# Altium schematic sheet Schémas V1.SchDoc
size A3; DocumentNumber: 2; SheetNumber: 1
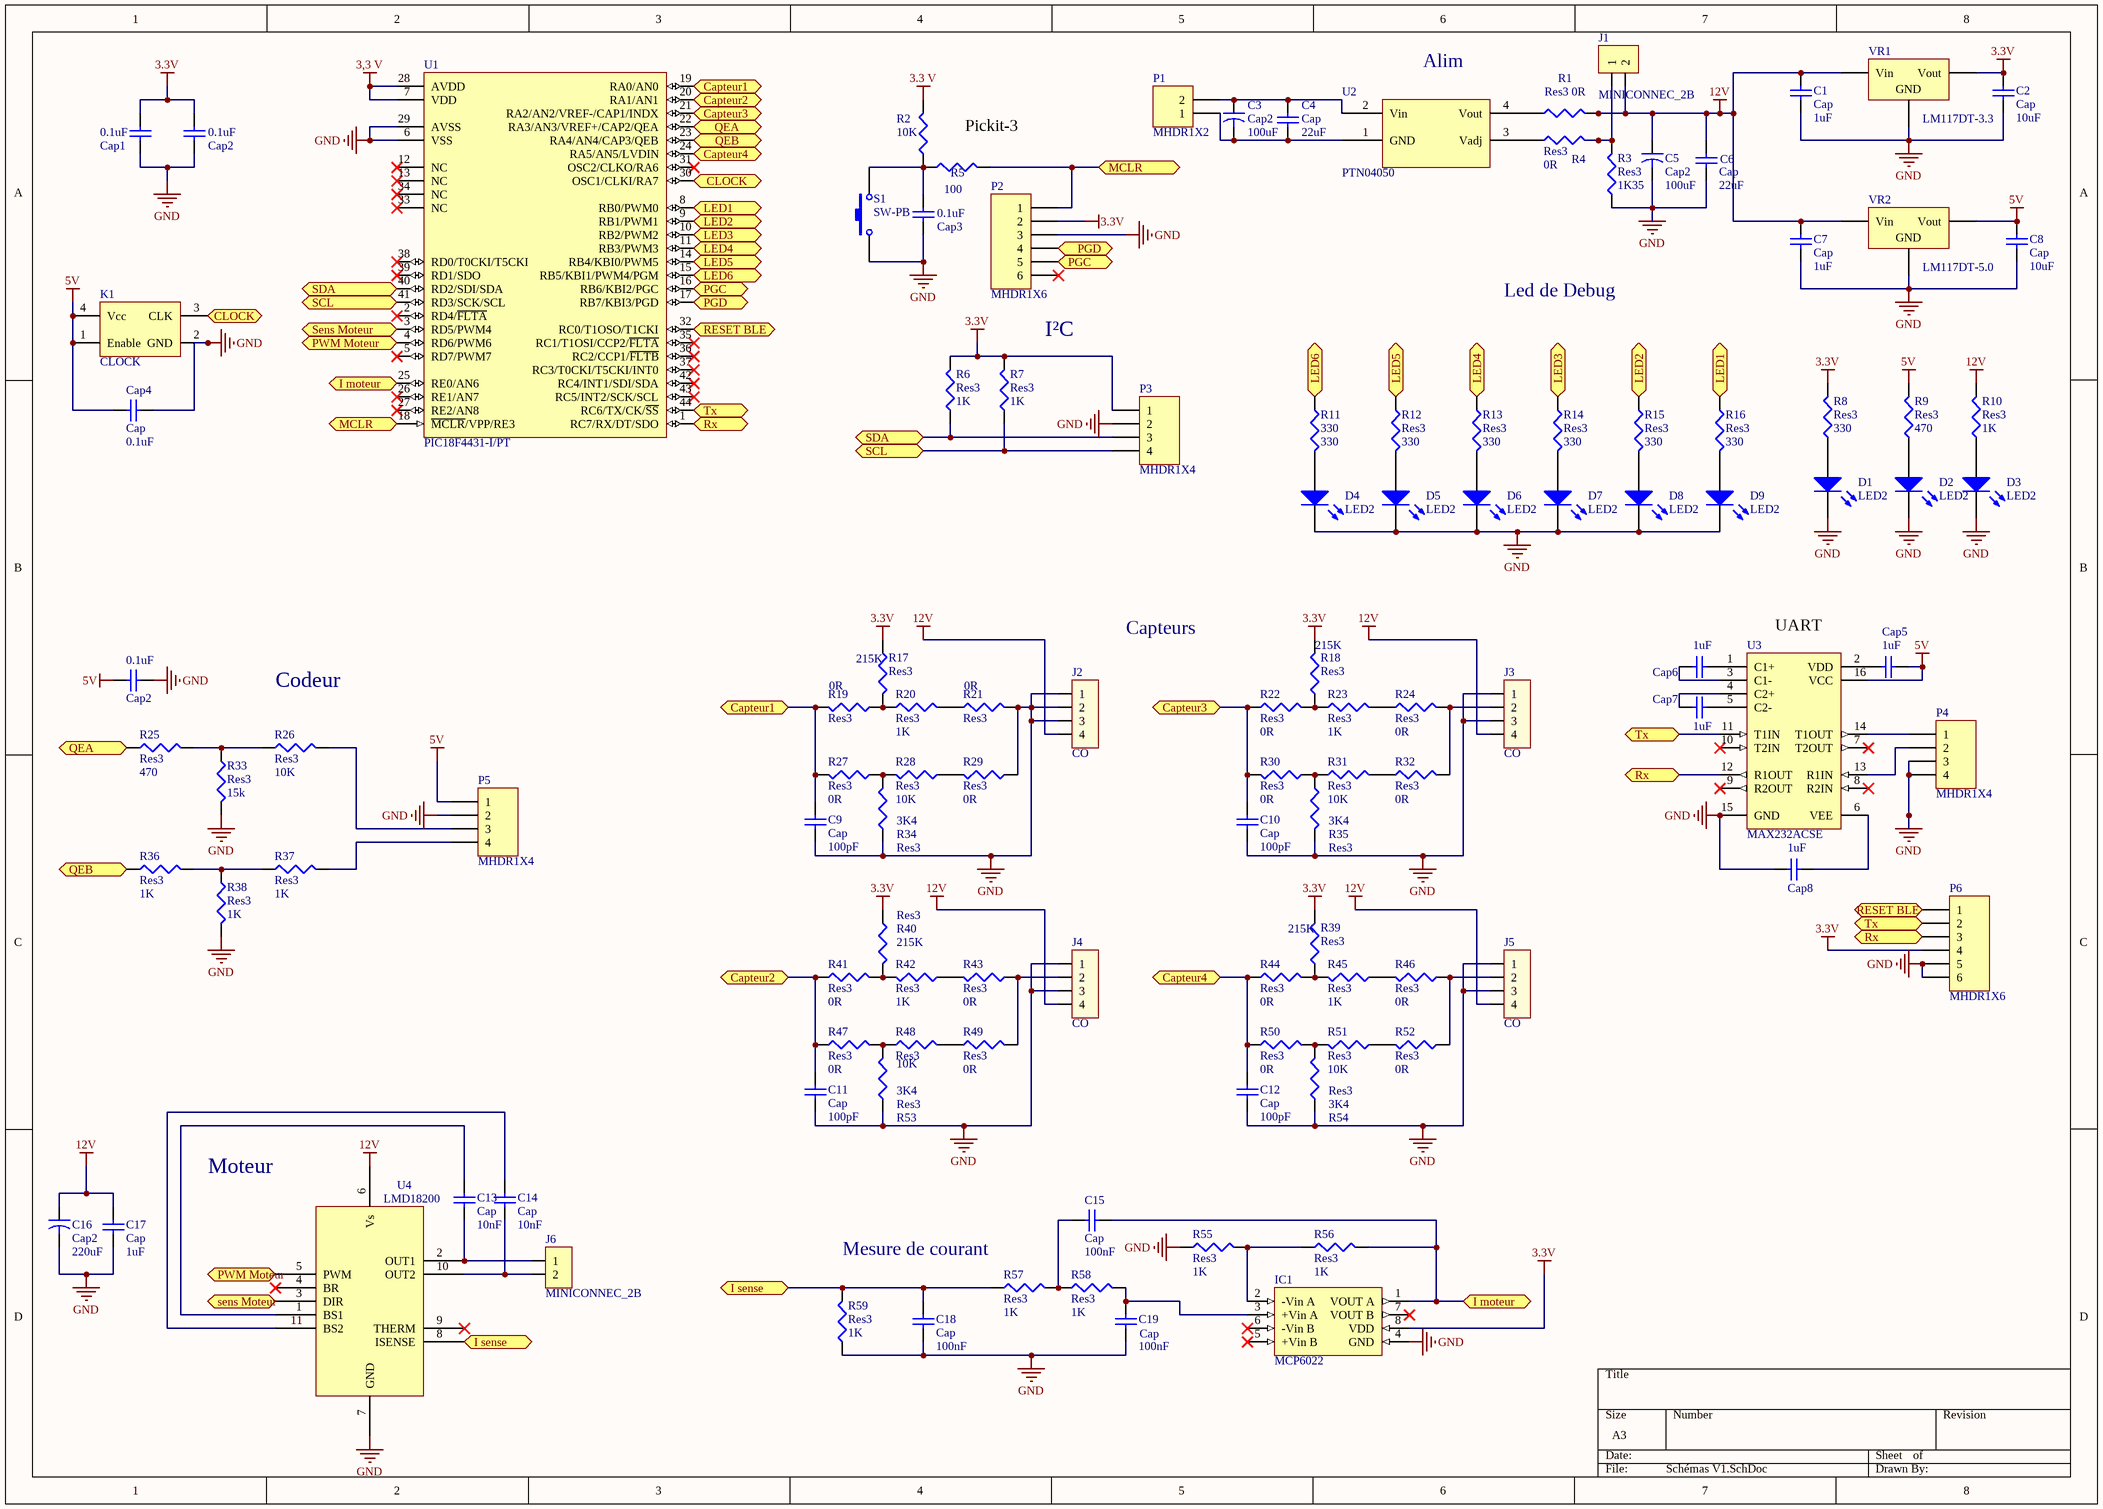
[diagram p0: Schémas V1.SchDoc]

## Parts
0.1uF  Cap2  [RAD-0.3]
C1  Cap  value 1uF  [RAD-0.3]
C2  Cap  value 10uF  [RAD-0.3]
C3  Cap2  value 100uF  [CAPR5-4X5]
C4  Cap  value 22uF  [RAD-0.3]
C5  Cap2  value 100uF  [CAPR5-4X5]
C6  Cap  value 22uF  [RAD-0.3]
C7  Cap  value 1uF  [RAD-0.3]
C8  Cap  value 10uF  [RAD-0.3]
C9  Cap  value 100pF  [RAD-0.3]
C10  Cap  value 100pF  [RAD-0.3]
C11  Cap  value 100pF  [RAD-0.3]
C12  Cap  value 100pF  [RAD-0.3]
C13  Cap  value 10nF  [RAD-0.3]
C14  Cap  value 10nF  [RAD-0.3]
C15  Cap  value 100nF  [RAD-0.3]
C16  Cap2  value 220uF  [CAPR5-4X5]
C17  Cap  value 1uF  [RAD-0.3]
C18  Cap  value 100nF  [RAD-0.3]
C19  Cap  value 100nF  [RAD-0.3]
Cap1  0.1uF  [RAD-0.3]
Cap2  0.1uF  [RAD-0.3]
Cap3  0.1uF  [RAD-0.3]
Cap4  Cap  value 0.1uF  [RAD-0.3]
Cap5  1uF  [RAD-0.3]
Cap6  1uF  [RAD-0.3]
Cap7  1uF  [RAD-0.3]
Cap8  1uF  [RAD-0.3]
D1  LED2  [DSO-F2/D6.1]
D2  LED2  [DSO-F2/D6.1]
D3  LED2  [DSO-F2/D6.1]
D4  LED2  [DSO-F2/D6.1]
D5  LED2  [DSO-F2/D6.1]
D6  LED2  [DSO-F2/D6.1]
D7  LED2  [DSO-F2/D6.1]
D8  LED2  [DSO-F2/D6.1]
D9  LED2  [DSO-F2/D6.1]
IC1  MCP6022  [SOIC 4B]
J1  MINICONNEC_2B  [MINICONNEC_C]
J2  CO  [MICRO-MATCH FOB.04P]
J3  CO  [MICRO-MATCH FOB.04P]
J4  CO  [MICRO-MATCH FOB.04P]
J5  CO  [MICRO-MATCH FOB.04P]
J6  MINICONNEC_2B  [MINICONNEC_C]
K1  CLOCK  [IQXO-70]
P1  MHDR1X2  [MHDR1X2]
P2  MHDR1X6  [MHDR1X6]
P3  MHDR1X4  [MHDR1X4]
P4  MHDR1X4  [MHDR1X4]
P5  MHDR1X4  [MHDR1X4]
P6  MHDR1X6  [MHDR1X6]
R1  Res3  value 0R  [RESC1608L]
R2  value 10K  [RESC1608L]  (hidden comment: Res3)
R3  Res3  value 1K35  [RESC1608L]
R4  Res3  value 0R  [RESC1608L]
R5  R1: 100  [RESC1608L]
R6  Res3  value 1K  [RESC1608L]
R7  Res3  value 1K  [RESC1608L]
R8  Res3  value 330  [RESC1608L]
R9  Res3  value 470  [RESC1608L]
R10  Res3  value 1K  [RESC1608L]
R11  330  [RESC1608L]
R12  Res3  value 330  [RESC1608L]
R13  Res3  value 330  [RESC1608L]
R14  Res3  value 330  [RESC1608L]
R15  Res3  value 330  [RESC1608L]
R16  Res3  value 330  [RESC1608L]
R17  Res3  value 215K  [RESC1608L]
R18  Res3  value 215K  [RESC1608L]
R19  Res3  value 0R  [RESC1608L]
R20  Res3  value 1K  [RESC1608L]
R21  Res3  value 0R  [RESC1608L]
R22  Res3  value 0R  [RESC1608L]
R23  Res3  value 1K  [RESC1608L]
R24  Res3  value 0R  [RESC1608L]
R25  Res3  value 470  [RESC1608L]
R26  Res3  value 10K  [RESC1608L]
R27  Res3  value 0R  [RESC1608L]
R28  Res3  value 10K  [RESC1608L]
R29  Res3  value 0R  [RESC1608L]
R30  Res3  value 0R  [RESC1608L]
R31  Res3  value 10K  [RESC1608L]
R32  Res3  value 0R  [RESC1608L]
R33  Res3  value 15k  [RESC1608L]
R34  Res3  value 3K4  [RESC1608L]
R35  Res3  value 3K4  [RESC1608L]
R36  Res3  value 1K  [RESC1608L]
R37  Res3  value 1K  [RESC1608L]
R38  Res3  value 1K  [RESC1608L]
R39  Res3  value 215K  [RESC1608L]
R40  Res3  value 215K  [RESC1608L]
R41  Res3  value 0R  [RESC1608L]
R42  Res3  value 1K  [RESC1608L]
R43  Res3  value 0R  [RESC1608L]
R44  Res3  value 0R  [RESC1608L]
R45  Res3  value 1K  [RESC1608L]
R46  Res3  value 0R  [RESC1608L]
R47  Res3  value 0R  [RESC1608L]
R48  Res3  value 10K  [RESC1608L]
R49  Res3  value 0R  [RESC1608L]
R50  Res3  value 0R  [RESC1608L]
R51  Res3  value 10K  [RESC1608L]
R52  Res3  value 0R  [RESC1608L]
R53  Res3  value 3K4  [RESC1608L]
R54  Res3  value 3K4  [RESC1608L]
R55  Res3  value 1K  [RESC1608L]
R56  Res3  value 1K  [RESC1608L]
R57  Res3  value 1K  [RESC1608L]
R58  Res3  value 1K  [RESC1608L]
R59  Res3  value 1K  [RESC1608L]
S1  SW-PB  [SPST-2]
U1  PIC18F4431-I/PT  [TQFP-PT44_L]
U2  PTN04050  [PTN04050]
U3  MAX232ACSE  [NSO16_M]
U4  LMD18200  [TA11B]  (value not drawn)
VR1  LM117DT-3.3  [TO254P1510-3_4N]
VR2  LM117DT-5.0  [TO254P1510-3_4N]

## Ports
Capteur1 (bidir), Capteur2 (bidir), Capteur3 (bidir), Capteur4 (bidir), CLOCK (bidir), I moteur (bidir), I sense, LED1 (bidir), LED2 (bidir), LED3 (bidir), LED4 (bidir), LED5 (bidir), LED6 (bidir), MCLR (bidir), PGC (bidir), PGD (bidir), PWM Moteur (bidir), QEA (bidir), QEB (bidir), RESET BLE (bidir), Rx (bidir), SCL (bidir), SDA (bidir), Sens Moteur (bidir), sens Moteur (bidir), Tx (bidir)

## Nets
3,3 V: U1.7(VDD) U1.28(AVDD)
3.3 V: R2.2
3.3V: C2.2 Cap1.2 Cap2.2 IC1.8(VDD) P2.2 P3.1 P6.4 R6.2 R7.2 R8.2 R17.1 R18.2 R39.2 R40.1 VR1.3(Vout)
5V: 0.1uF.2 C8.2 Cap4.1 Cap5.1 K1.1(Enable) K1.4(Vcc) P5.1 R9.2 U3.16(VCC) VR2.3(Vout)
12V: C1.2 C5.1 C6.2 C7.2 C16.1 C17.2 J1.2 J2.4 J3.4 J4.4 J5.4 R1.2 R10.2 U4.6(Vs) VR1.1(Vin) VR2.1(Vin)
GND: 0.1uF.1 C1.1 C2.1 C5.2 C6.1 C7.1 C8.1 C9.2 C10.2 C11.2 C12.2 C16.2 C17.1 C18.1 C19.1 Cap1.1 Cap2.1 Cap3.1 Cap4.2 Cap8.1 D1.2(K) D2.2(K) D3.2(K) D4.2(K) D5.2(K) D6.2(K) D7.2(K) D8.2(K) D9.2(K) IC1.4(GND) J2.1 J2.2 J2.3 J3.1 J3.3 J4.1 J4.3 J5.1 J5.3 K1.2(GND) P2.3 P3.2 P4.3 P4.4 P5.2 P6.5 P6.6 R3.1 R21.2 R29.1 R33.2 R34.1 R35.2 R38.2 R53.1 R54.1 R55.1 R59.1 S1.1 U1.6(VSS) U1.29(AVSS) U3.15(GND) U4.7(GND) VR1.2(GND) VR2.2(GND)
Capteur1: C9.1 R19.2 R27.2 U1.19(RA0/AN0) ; port Capteur1
Capteur2: C11.1 R41.1 R47.1 U1.20(RA1/AN1) ; port Capteur2
Capteur3: C10.1 R22.1 R30.2 U1.21(RA2/AN2/VREF-/CAP1/INDX) ; port Capteur3
Capteur4: C12.1 R44.1 R50.1 U1.24(RA5/AN5/LVDIN) ; port Capteur4
CLOCK: K1.3(CLK) U1.30(OSC1/CLKI/RA7) ; port CLOCK
I moteur: C15.1 IC1.1(VOUT_A) R56.2 U1.25(RE0/AN6) ; port I moteur
I sense: C18.2 R57.1 R59.2 U4.8(ISENSE) ; port I sense
LED1: R16.1 U1.8(RB0/PWM0) ; port LED1
LED2: R15.1 U1.9(RB1/PWM1) ; port LED2
LED3: R14.1 U1.10(RB2/PWM2) ; port LED3
LED4: R13.1 U1.11(RB3/PWM3) ; port LED4
LED5: R12.1 U1.14(RB4/KBI0/PWM5) ; port LED5
LED6: R11.1 U1.15(RB5/KBI1/PWM4/PGM) ; port LED6
MCLR: P2.1 R5.2 U1.18(~{MCLR}/VPP/RE3) ; port MCLR
PGC: P2.5 U1.16(RB6/KBI2/PGC) ; port PGC
PGD: P2.4 U1.17(RB7/KBI3/PGD) ; port PGD
PWM Moteur: U1.4(RD6/PWM6) U4.5(PWM) ; port PWM Moteur
QEA: R25.1 U1.22(RA3/AN3/VREF+/CAP2/QEA) ; port QEA
QEB: R36.1 U1.23(RA4/AN4/CAP3/QEB) ; port QEB
RESET BLE: P6.1 U1.32(RC0/T1OSO/T1CKI) ; port RESET BLE
Rx: P6.3 U1.1(RC7/RX/DT/SDO) U3.12(R1OUT) ; port Rx
SCL: P3.4 R7.1 U1.41(RD3/SCK/SCL) ; port SCL
SDA: P3.3 R6.1 U1.40(RD2/SDI/SDA) ; port SDA
Sens Moteur: U1.3(RD5/PWM4) U4.3(DIR) ; port Sens Moteur, port sens Moteur
Tx: P6.2 U1.44(RC6/TX/CK/~{SS}) U3.11(T1IN) ; port Tx
NetC3_1: C3.1 C4.2 P1.2 U2.2(Vin)
NetC3_2: C3.2 C4.1 P1.1 U2.1(GND)
NetC13_1: C13.1 U4.1(BS1)
NetC13_2: C13.2 J6.1 U4.2(OUT1)
NetC14_1: C14.1 U4.11(BS2)
NetC14_2: C14.2 J6.2 U4.10(OUT2)
NetC15_2: C15.2 R57.2 R58.1
NetC19_2: C19.2 IC1.3(+Vin_A) R58.2
NetCap3_2: Cap3.2 R2.1 R5.1 S1.2
NetCap5_2: Cap5.2 U3.2(VDD)
NetCap6_1: Cap6.1 U3.1(C1+)
NetCap6_2: Cap6.2 U3.3(C1-)
NetCap7_1: Cap7.1 U3.5(C2-)
NetCap7_2: Cap7.2 U3.4(C2+)
NetCap8_2: Cap8.2 U3.6(VEE)
NetD1_1: D1.1(A) R8.1
NetD2_1: D2.1(A) R9.1
NetD3_1: D3.1(A) R10.1
NetD4_1: D4.1(A) R11.2
NetD5_1: D5.1(A) R12.2
NetD6_1: D6.1(A) R13.2
NetD7_1: D7.1(A) R14.2
NetD8_1: D8.1(A) R15.2
NetD9_1: D9.1(A) R16.2
NetIC1_2: IC1.2(-Vin_A) R55.2 R56.1
NetJ1_1: J1.1 R3.2 R4.2
NetJ3_2: J3.2 R24.2 R32.2
NetJ4_2: J4.2 R43.1 R49.2
NetJ5_2: J5.2 R46.1 R52.1
NetP4_1: P4.1 U3.14(T1OUT)
NetP4_2: P4.2 U3.13(R1IN)
NetP5_3: P5.3 R26.2
NetP5_4: P5.4 R37.2
NetR1_1: R1.1 U2.4(Vout)
NetR4_1: R4.1 U2.3(Vadj)
NetR17_2: R17.2 R19.1 R20.1
NetR18_1: R18.1 R22.2 R23.1
NetR20_2: R20.2 R21.1
NetR23_2: R23.2 R24.1
NetR25_2: R25.2 R26.1 R33.1
NetR27_1: R27.1 R28.2 R34.2
NetR28_1: R28.1 R29.2
NetR30_1: R30.1 R31.1 R35.1
NetR31_2: R31.2 R32.1
NetR36_2: R36.2 R37.1 R38.1
NetR39_1: R39.1 R44.2 R45.2
NetR40_2: R40.2 R41.2 R42.2
NetR42_1: R42.1 R43.2
NetR45_1: R45.1 R46.2
NetR47_2: R47.2 R48.1 R53.2
NetR48_2: R48.2 R49.1
NetR50_2: R50.2 R51.2 R54.2
NetR51_1: R51.1 R52.2

Not connected (* = marked no-connect by the designer): IC1 5(+Vin_B)* 6(-Vin_B)* 7(VOUT_B)*; P2 6*; U1 2(RD4/~{FLTA})* 5(RD7/PWM7)* 12(NC)* 13(NC)* 26(RE1/AN7)* 27(RE2/AN8)* 31(OSC2/CLKO/RA6)* 33(NC)* 34(NC)* 35(RC1/T1OSI/CCP2/~{FLTA})* 36(RC2/CCP1/~{FLTB})* 37(RC3/T0CKI/T5CKI/INT0)* 38(RD0/T0CKI/T5CKI)* 39(RD1/SDO)* 42(RC4/INT1/SDI/SDA)* 43(RC5/INT2/SCK/SCL)*; U3 7(T2OUT)* 8(R2IN)* 9(R2OUT)* 10(T2IN)*; U4 4(BR)* 9(THERM)*

## Notes on the sheet
- (near U2) Alim
- Pickit-3
- Led de Debug
- I²C
- Capteurs
- (near U3) UART
- Codeur
- (near U4) Moteur
- Mesure de courant

## Library data of the parts
0.1uF C1 C2 C4 C6-C15 C17-C19 Cap1-Cap8 = Cap: Capacitor; Published: 8-Jun-2000; LatestRevisionDate: 17-Jul-2002; LatestRevisionNote: Re-released for DXP Platform.; PackageReference: RAD-0.3; Publisher: Altium Limited
C3 C5 C16 = Cap2: Capacitor; Published: 23-Sep-2002; PackageReference: CAPR5-4X5; Publisher: Altium Limited
D1-D9 = LED2: Typical RED, GREEN, YELLOW, AMBER GaAs LED; Published: 8-Jun-2000; LatestRevisionDate: 17-Jul-2002; LatestRevisionNote: Re-released for DXP Platform.; PackageVersion: Feb-2002; PackageReference: 3.2X1.6X1.1; Publisher: Altium Limited
IC1 = MCP6022: AOP Microchip
J1 J6 = MINICONNEC_2B: Connecteur
J2-J5 = MICRO-MATCH FOB.04P: Connecteur
K1 = OSCILLATEUR: Oscillateur quartz
P1 = MHDR1X2: Header, 2-Pin; LatestRevisionDate: 17-Jul-2002; LatestRevisionNote: Re-released for DXP Platform.; Publisher: Altium Limited
P2 P6 = MHDR1X6: Header, 6-Pin; LatestRevisionDate: 17-Jul-2002; LatestRevisionNote: Re-released for DXP Platform.; Publisher: Altium Limited
P3-P5 = MHDR1X4: Header, 4-Pin; LatestRevisionDate: 17-Jul-2002; LatestRevisionNote: Re-released for DXP Platform.; Publisher: Altium Limited
R1-R59 = Res3: Resistor; Published: 8-Jun-2000; LatestRevisionDate: 29-May-2009; LatestRevisionNote: IPC-7351 Footprint Added.; PackageReference: J1-0603; Publisher: Altium Limited; PackageDescription: Chip Resistor
  R11: Value: 330
S1 = SW-PB: Switch; Published: 24-Mar-1999; LatestRevisionDate: 17-Jul-2002; LatestRevisionNote: Re-released for DXP Platform.; PackageReference: SPST-2; Publisher: Altium Limited
U1 = PIC18F4431-I/PT: Enhanced Flash Microcontroller with nanoWatt Technology, High Performance PWM and A/D, 16K Flash, 44-Pin TQFP, Industrial Temperature; FirstPublished: 11-Oct-2004; LatestRevisionDate: 29-Jan-2009; LatestRevisionNote: Sch. layout revised. 3D Model Removed.; DatasheetVersion: revC, Jul-2007; PackageVersion: revBB, Aug-2009; PackageReference: TQFP-PT44; Publisher: Altium Limited; PackageDescription: 44-Lead Plastic Thin Quad Flatpack (PT) - 10x10x1mm Body, 2.00mm [TQFP]; Supplier 1: Digi-Key; Supplier Part Number 1: PIC18F4431-I/PT-ND; Supplier 2: Farnell; Supplier Part Number 2: 1137346; Supplier 3: Farnell; Supplier Part Number 3: 1137420; Supplier 4: Farnell; Supplier Part Number 4: 1528308; Supplier 5: Newark; Supplier Part Number 5: 61K3473; Code_JEDEC: MS-026; ComponentLink1Description: Datasheet; ComponentLink1URL: http://ww1.microchip.com/downloads/en/DeviceDoc/39616C.pdf; ComponentLink2Description: Packaging Specification; ComponentLink2URL: http://www.microchip.com/stellent/groups/techpub_sg/documents/packagingspec/en012702.pdf; ComponentLink3Description: Microchip.com Home; ComponentLink3URL: http://www.microchip.com/
U2 = PTN04050: BOOST
U3 = MAX232ACSE: +5V Powered, Multi-Channel RS-232 Driver/Receiver; Published: 16-Jan-2001; LatestRevisionDate: 13-Apr-2006; LatestRevisionNote: IPC-7351 Footprint Added.; PackageReference: NSO16; Publisher: Altium Limited; PackageDescription: 16-Pin Small Outline Integrated Circuit 1.27 mm Pitch; Code_JEDEC: MS-012-AC; Code_IPC: SOIC127P600-16; ComponentLink1Description: Manufacturer Link; ComponentLink1URL: http://www.maxim-ic.com/; ComponentLink2Description: Datasheet; ComponentLink2URL: http://pdfserv.maxim-ic.com/en/ds/MAX220-MAX249.pdf
U4 = LMD18200: Pont-H
VR1 VR2 = Volt Reg: Voltage Regulator; Published: 24-Mar-1999; LatestRevisionDate: 29-May-2009; LatestRevisionNote: IPC-7351 Footprint Added.; PackageReference: D2PAK; Publisher: Altium Limited; PackageDescription: 3-Pin Transistor Outline Package 2.54 mm Pitch, 15.1 mm Lead Span